# EAGLE design SHIELD (EAGLE 9.6.2)
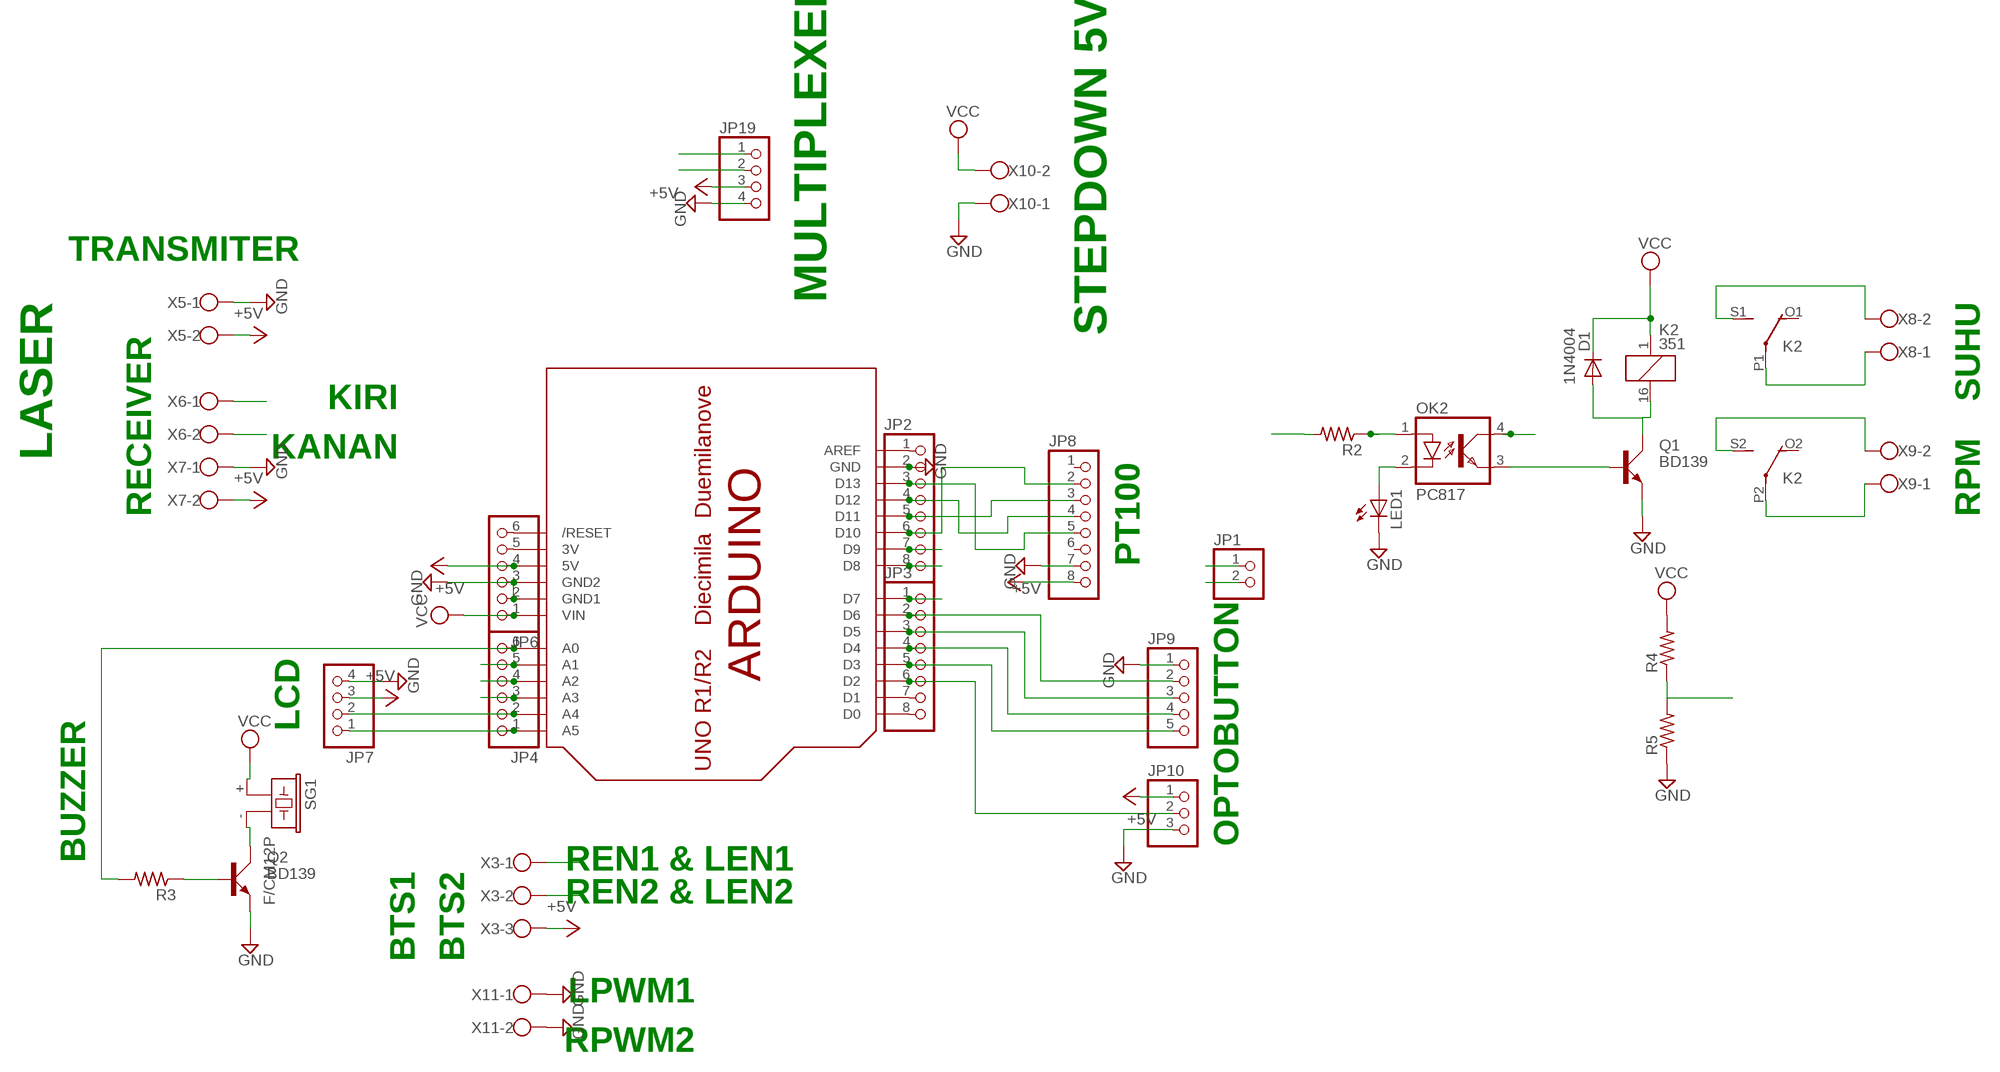
[diagram p0: schematic, sheet 1]

## Parts
D1  1N4004  [DO41-10]
JP1  PINHD-1X2  [1X02]
JP2  PINHD-1X8  [1X08]
JP3  PINHD-1X8  [1X08]
JP4  PINHD-1X6  [1X06]
JP6  PINHD-1X6  [1X06]
JP7  PINHD-1X4  [1X04]
JP8  PINHD-1X8  [1X08]
JP9  PINHD-1X5  [1X05]
JP10  PINHD-1X3  [1X03]
JP19  PINHD-1X4  [1X04]
K2  351  [351]
LED1  LED5MM  [LED5MM]
OK2  PC817  [DIL04]
Q1  BD139  [TO126AV]
Q2  BD139  [TO126AV]
R2  R-US_0207/10  [0207/10]
R3  R-US_0207/10  [0207/10]
R4  R-US_0207/10  [0207/10]
R5  R-US_0207/10  [0207/10]
SG1  F/CM12P  [F/CM12P]
U$1  ARDUINO-NOHOLE  [ARDUINO-NOHOLE]
X3  W237-103  [W237-103]
X5  W237-102  [W237-102]
X6  W237-102  [W237-102]
X7  W237-102  [W237-102]
X8  W237-102  [W237-102]
X9  W237-102  [W237-102]
X10  W237-102  [W237-102]
X11  W237-102  [W237-102]

## Nets
+5V: JP6.4 JP7.3 JP8.8 JP10.1 JP19.3 U$1.5V X3.3 X5.2 X7.2
GND: JP2.2 JP6.2 JP6.3 JP7.4 JP8.7 JP9.1 JP10.3 JP19.4 LED1.K(C) Q1.E Q2.E R5.1 U$1.GND U$1.GND1 U$1.GND2 X5.1 X7.1 X10.1 X11.1 X11.2
N$1: JP1.1 JP1.2 JP2.7 U$1.D9
N$2: Q2.B R3.1
N$3: Q2.C SG1.-
N$4: JP2.1 U$1.AREF
N$5: JP3.7 U$1.D1
N$6: JP3.8 U$1.D0
N$9: JP4.2 JP7.2 JP19.2 U$1.A4
N$10: JP4.1 JP7.1 JP19.1 U$1.A5
N$11: JP2.6 JP8.2 U$1.D10
N$12: JP2.5 JP8.3 U$1.D11
N$13: JP2.4 JP8.4 U$1.D12
N$14: JP6.5 U$1.3V
N$15: JP6.6 U$1.RESET(/RESET)
N$18: JP2.3 JP8.5 U$1.D13
N$19: JP3.5 JP9.5 U$1.D3
N$20: JP3.4 JP9.4 U$1.D4
N$21: JP3.3 JP9.3 U$1.D5
N$22: JP3.2 JP9.2 U$1.D6
N$23: JP3.6 JP10.2 U$1.D2
N$24: JP4.6 R3.2 U$1.A0
N$26: JP4.4 U$1.A2 X3.2
N$27: JP3.1 U$1.D7 X6.2
N$28: JP4.5 U$1.A1 X3.1
N$29: JP2.8 U$1.D8 X6.1
N$30: D1.A K2.16 Q1.C
N$31: OK2.3(EMIT) Q1.B
N$32: JP4.3 R2.2 U$1.A3
N$33: LED1.A OK2.2(C)
N$34: OK2.1(A) R2.1
N$35: K2.S1(2:S) X8.2
N$36: K2.P2(3:P) X9.1
N$37: OK2.4(COL) R4.1 R5.2
N$38: K2.S2(3:S) X9.2
N$39: K2.P1(2:P) X8.1
VCC: D1.C JP6.1 K2.1 R4.2 SG1.+ U$1.VIN X10.2
Unconnected: JP8.1 JP8.6 K2.O1(2:O) K2.O2(3:O)

## Notes on the sheet
- TRANSMITER
- LASER | MULTIPLEXER
- STEPDOWN 5V
- KIRI
- SUHU
- KANAN
- RECEIVER | RPM
- PT100
- LCD
- BUTTON
- REN1 & LEN1 | OPTO
- BUZZER
- REN2 & LEN2
- BTS1 | BTS2
- LPWM1
- RPWM2

## Library data of the parts
D1 = adafruit:1N4004: DIODE General purpose 1N400x type rectifier (With bigger pads) http://www.ladyada.net/library/pcb/eaglelibrary.html
JP1 = pinhead:PINHD-1X2: PIN HEADER
JP2 JP3 JP8 = pinhead:PINHD-1X8: PIN HEADER
JP4 JP6 = pinhead:PINHD-1X6: PIN HEADER
JP7 JP19 = pinhead:PINHD-1X4: PIN HEADER
JP9 = pinhead:PINHD-1X5: PIN HEADER
JP10 = pinhead:PINHD-1X3: PIN HEADER
K2 = relay:351: RELAY 2 x switch, Omron; OC_FARNELL: unknown; OC_NEWARK: unknown
LED1 = adafruit:LED: LED OSRAM: - CHIPLED LG R971, LG N971, LY N971, LG Q971, LY Q971, LO R971, LY R971 LH N974, LH R974 LS Q976, LO Q976, LY Q976 LO Q996 - Hyper CHIPLED LW Q18S LB Q993, LB Q99A, LB R99A - SideLED LS A670, LO A670, LY A670, LG A670, LP A670 LB A673, LV A673, LT A673, LW A673 LH A674 LY A675 LS A676, LA A676, LO A676, LY A676, LW A676 LS A679, LY A679, LG A679 - Hyper Micro SIDELED® LS Y876, LA Y876, LO Y876, LY Y876 LT Y87S - SmartLED LW L88C, LW L88S LB L89C, LB L89S, LG L890 LS L89K, LO L89K, LY L89K LS L896, LA L896, LO L896, LY L896 - TOPLED LS T670, LO T670, LY T670, LG T670, LP T670 LSG T670, LSP T670, LSY T670, LOP T670, LYG T670 LG T671, LOG T671, LSG T671 LB T673, LV T673, LT T673, LW T673 LH T674 LS T676, LA T676, LO T676, LY T676, LB T676, LH T676, LSB T676, LW T676 LB T67C, LV T67C, LT T67C, LS T67K, LO T67K, LY T67K, LW E67C LS E67B, LA E67B, LO E67B, LY E67B, LB E67C, LV E67C, LT E67C LW T67C LS T679, LY T679, LG T679 LS T770, LO T770, LY T770, LG T770, LP T770 LB T773, LV T773, LT T773, LW T773 LH T774 LS E675, LA E675, LY E675, LS T675 LS T776, LA T776, LO T776, LY T776, LB T776 LHGB T686 LT T68C, LB T68C - Hyper Mini TOPLED® LB M676 - Mini TOPLED Santana® LG M470 LS M47K, LO M47K, LY M47K Source: http://www.osram.convergy.de/
OK2 = optocoupler:PC817: SHARP OPTO COUPLER; MPN: PC817X4J000F; OC_FARNELL: 9707727; OC_NEWARK: 97K7059
Q1 Q2 = transistor-power:BD139: NPN TRANSISTOR
R2-R5 = rcl:R-US_: RESISTOR, American symbol; SPICEPREFIX: R
SG1 = buzzer:F/CM12P: BUZZER Source: Buerklin; OC_FARNELL: unknown; OC_NEWARK: unknown
U$1 = adafruit:ARDUINO: Arduino Diecimila/Duemilanove Make a shield with ease, this package has all the named pins as well as the two mounting drill holes and an outline of the USB and DC power connector. The outline is on the DIMENSION layer, so if your board house uses it they will cut the outline to match. http://www.ladyada.net/library/pcb/eaglelibrary.html
X3 = con-wago-500:W237-103: WAGO SCREW CLAMP; MPN: 237-103; OC_FARNELL: unknown; OC_NEWARK: 18M7116
X5-X11 = con-wago-500:W237-102: WAGO SCREW CLAMP; MPN: 237-102; OC_FARNELL: unknown; OC_NEWARK: 70K9898

## Board
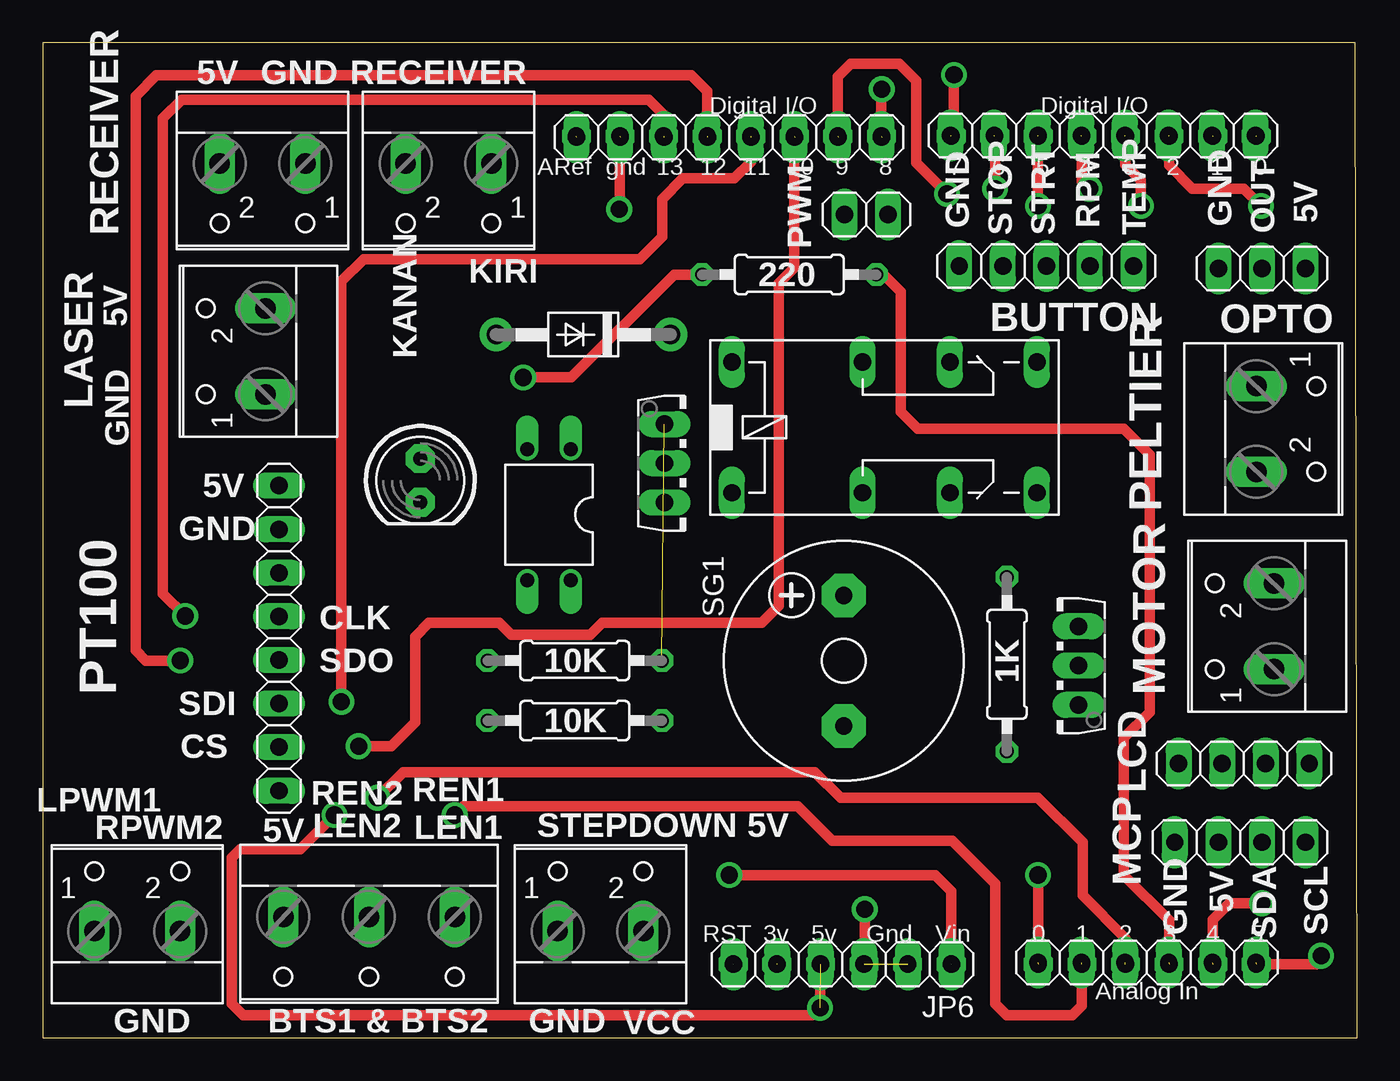
[diagram p1: board, top side]
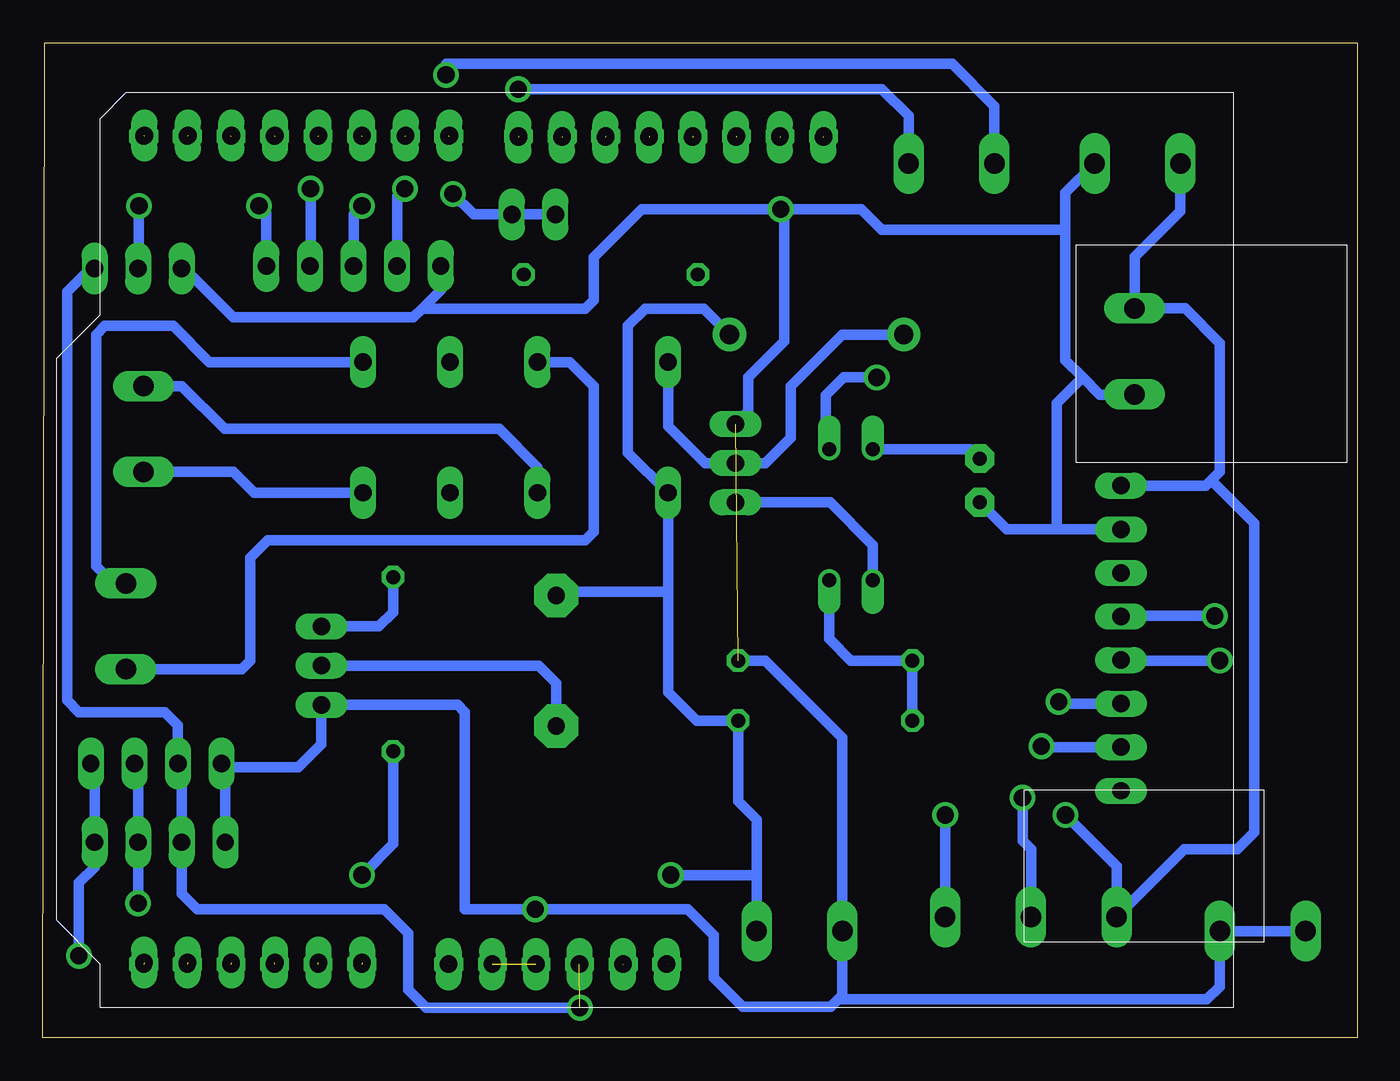
[diagram p2: board, bottom side, seen from below]

Size 76.6 x 58 mm. Coordinates in mm from the lower left corner, seen from the top.
Outline: 0,0 76.6,0 76.5,58 0,58 0,0
Copper layers (1*16): Top 0.035mm / dielectric 1.5mm / Bottom 0.035mm
Design rules "default": minimum track width 6mil, minimum drill 0.35mm, track to track 6mil, track to pad 6mil, pad to pad 6mil, via to via 6mil, smd to smd 6mil, copper to edge 40mil, drill to drill 6mil, minimum pad ring 10mil, minimum via ring 8mil, stop-mask expansion 4mil, vias tented up to drill 0mil, thermal gap 10mil

### Footprints (pad centres in the part's own frame; a part is rotated, then mirrored left to right if it is on the bottom)
DO41-10 = drill 1.118 pad 1.93: A 5.08,0; C -5.08,0
1X02 = drill 1.016 long: 1 -1.27,0; 2 1.27,0
1X08 = drill 1.016 long: 1 -8.89,0; 2 -6.35,0; 3 -3.81,0; 4 -1.27,0; 5 1.27,0; 6 3.81,0; 7 6.35,0; 8 8.89,0
1X06 = drill 1.016 long: 1 -6.35,0; 2 -3.81,0; 3 -1.27,0; 4 1.27,0; 5 3.81,0; 6 6.35,0
1X04 = drill 1.016 long: 1 -3.81,0; 2 -1.27,0; 3 1.27,0; 4 3.81,0
1X05 = drill 1.016 long: 1 -5.08,0; 2 -2.54,0; 3 0,0; 4 2.54,0; 5 5.08,0
1X03 = drill 1.016 long: 1 -2.54,0; 2 0,0; 3 2.54,0
351 = drill 1.016 long: 1 -3.81,-3.81; 16 -3.81,3.81; O1 8.89,-3.81; O2 8.89,3.81; P1 3.81,-3.81; P2 3.81,3.81; S1 13.97,-3.81; S2 13.97,3.81
LED5MM = drill 0.813 pad 1.676 octagon: A -1.27,0; K 1.27,0
DIL04 = drill 0.813 offset: 1 -1.27,-3.81; 2 1.27,-3.81; 3 1.27,3.81; 4 -1.27,3.81
TO126AV = drill 1.016 long: B 2.286,-1.27; C 0,-1.27; E -2.286,-1.27
0207/10 = drill 0.813 octagon: 1 -5.08,0; 2 5.08,0
F/CM12P = drill 1.016 pad 2.54 octagon: + 3.81,0; - -3.81,0
ARDUINO-NOHOLE = drill 1 pad 1.676 octagon: 3V 35.56,2.54; 5V 38.1,2.54; A0 50.8,2.54; A1 53.34,2.54; A2 55.88,2.54; A3 58.42,2.54; A4 60.96,2.54; A5 63.5,2.54; AREF 23.876,50.8; D0 63.5,50.8; D1 60.96,50.8; D2 58.42,50.8; D3 55.88,50.8; D4 53.34,50.8; D5 50.8,50.8; D6 48.26,50.8; D7 45.72,50.8; D8 41.656,50.8; D9 39.116,50.8; D10 36.576,50.8; D11 34.036,50.8; D12 31.496,50.8; D13 28.956,50.8; GND 26.416,50.8; GND1 43.18,2.54; GND2 40.64,2.54; RESET 33.02,2.54; VIN 45.72,2.54
W237-103 = drill 1.194 long: 1 -5,-1.29; 2 0,-1.29; 3 5,-1.29
W237-102 = drill 1.194 long: 1 -2.5,-1.27; 2 2.5,-1.27

### Placement (x,y rotation side)
D1  31.5,41 180 top
JP1  48,48 0 top
JP2  40,52.5 0 top
JP3  61.8,52.6 0 top
JP4  64.35,4.4 180 top
JP6  46.6,4.3 180 top
JP7  69.78,11.41 180 top
JP8  13.76,23.3 90 top
JP9  58.49,44.99 0 top
JP10  71.05,44.86 180 top
JP19  70,16 180 top
K2  43.97,35.59 0 top
LED1  22,32.5 270 top
OK2  29.5,30.5 180 top
Q1  37.5,33.5 270 top
Q2  59.1,21.7 90 top
R2  43.5,44.5 0 top
R3  56.19,21.78 270 top
R4  31,18.5 0 top
R5  31,22 180 top
SG1  46.68,21.99 90 top
U$1  7.22,1.77 0 top
X3  19.01,5.77 180 top
X5  11.7,40.02 90 top
X6  23.64,49.7 180 top
X7  12.8,49.7 180 top
X8  72,35.5 270 top
X9  70.5,24 90 top
X10  32.5,7.5 0 top
X11  5.5,7.5 0 top

### Tracks (layer width: path | path; a pad name or v marks a point on that pad's centre or on a via)
+5V  (via drill 1 pad 1)  (1 unrouted)
  Top 0.61: U$1.5V 45.3,4.29 v45.3,1.77 44.85,1.32 11.68,1.32 11,2 11,10.5 11.5,11 15,11 v17,13
  Bottom 0.61: JP7.3 68.51,15.78 JP19.3 68.73,18.23 69.5,19 74.5,19 75.18,19.68 75.18,43.5 73.82,44.86 JP10.1 | JP8.8 8.81,32.19 8.5,32.5 | 8.5,32.5 8,33 8,40.5 10.02,42.52 X5.2 12.97,45.53 10.3,48.2 X7.2 | JP7.3 | 8.5,32.5 6,30 6,12 7,11 10.07,11 X3.3 14.01,10.01 v17,13 | v45.3,1.77 54.27,1.77 55.3,2.8 55.3,6.1 56.7,7.5 67.6,7.5 68.51,8.41 JP7.3
GND  (via drill 1 pad 1)  (5 unrouted)
  Top 0.61: U$1.GND2 47.9,4.31 v47.9,7.5 | U$1.GND 33.64,48.34 v33.6,48.3
  Bottom 0.61: JP7.4 65.97,15.78 | 65.97,15.78 JP19.4 | 65.97,15.78 61.72,15.78 60.37,17.13 Q2.E 52.41,19.41 52,19 52,7.5 v47.9,7.5 39,7.5 37.5,6 37.5,3.5 35.82,1.82 30.68,1.82 30.25,2.25 | R5.1 34.5,22 30,17.5 X10.1 30,2.5 30.25,2.25 | Q1.E 35.5,36.52 35.5,38.5 33.4,40.6 33.4,48.1 v33.6,48.3 | X11.1 X11.2 8,3 8.75,2.25 30.25,2.25 | X7.1 17,49.27 17,47.1 | 16,38.5 17,39.5 17,47.1 | 16,38.5 15,37.5 12.99,37.5 X5.1 | LED1.K 20.42,29.65 17.5,29.65 | 17.5,29.65 JP8.7 | JP9.1 53.41,43.59 54.5,42.5 | 54.5,42.5 55,42 65.5,42 68.36,44.86 JP10.3 | v33.6,48.3 41.7,48.3 44.5,45.5 44.5,43 45,42.5 54.5,42.5 | 16,38.5 17.5,37 17.5,29.65 | 17,47.1 27.7,47.1 28.9,48.3 v33.6,48.3
N$1  (via drill 1)  (1 unrouted)
  Top 0.61: U$1.D9 46.34,56.02 47.1,56.78 49.9,56.78 50.9,55.78 50.9,51 v52.7,49.2
  Bottom 0.61: v52.7,49.2 51.5,48 JP1.2 JP1.1
N$2
  Bottom 0.61: R3.1 56.19,24.81 57.01,23.99 Q2.B
N$3
  Bottom 0.61: SG1.- 46.68,20.68 47.7,21.7 Q2.C
N$4  (1 unrouted)
N$5  (1 unrouted)
N$6  (1 unrouted)
N$9  (via drill 1 pad 1)  (1 unrouted)
  Top 0.61: U$1.A4 68.18,6.88 69.15,7.85 v71.05,7.85
  Bottom 0.61: JP19.2 71.05,15.78 JP7.2 v71.05,7.85 71,7.8
N$10  (via drill 1 pad 1)  (1 unrouted)
  Top 0.61: U$1.A5 74.21,4.31 74.7,4.8 v74.5,4.8
  Bottom 0.61: JP19.1 73.59,15.78 JP7.1 73.59,9.95 74.5,9.04 v74.5,4.8
N$11  (via drill 1 pad 1)  (1 unrouted)
  Top 0.61: U$1.D10 43.8,44.9 42.9,44 42.9,25.2 41.9,24.2 32.6,24.2 31.9,23.5 27.3,23.5 26.6,24.2 22.5,24.2 21.7,23.4 21.7,18.4 20.3,17 v18.4,17
  Bottom 0.61: v18.4,17 18.35,16.95 JP8.2
N$12  (via drill 1 pad 1)  (1 unrouted)
  Top 0.61: U$1.D11 41.26,51.06 40.3,50.1 37.3,50.1 36.1,48.9 36.1,46.7 34.8,45.4 18.7,45.4 17.4,44.1 v17.4,19.6
  Bottom 0.61: v17.4,19.6 17.29,19.49 JP8.3
N$13  (via drill 1 pad 1)  (1 unrouted)
  Top 0.61: U$1.D12 38.72,55.18 37.8,56.1 6.6,56.1 5.4,54.9 5.4,22.6 6,22 v8,22
  Bottom 0.61: v8,22 13.73,22 JP8.4
N$14  (1 unrouted)
N$15  (1 unrouted)
N$18  (via drill 1 pad 1)  (1 unrouted)
  Top 0.61: U$1.D13 36.18,53.82 35.3,54.7 8.1,54.7 7,53.6 7,25.9 v8.3,24.6
  Bottom 0.61: v8.3,24.6 13.73,24.6 JP8.5
N$19  (via drill 1 pad 1)  (1 unrouted)
  Top 0.61: v64,48.5 64,50 63.1,50.9 U$1.D3
  Bottom 0.61: JP9.5 63.57,48.07 v64,48.5
N$20  (via drill 1 pad 1)  (1 unrouted)
  Top 0.61: U$1.D4 60.56,49.94 v61,49.5
  Bottom 0.61: v61,49.5 61,45.02 JP9.4
N$21  (via drill 1 pad 1)  (1 unrouted)
  Top 0.61: v58,48.5 58,52.55 U$1.D5
  Bottom 0.61: JP9.3 58.49,48.01 v58,48.5
N$22  (via drill 1 pad 1)  (1 unrouted)
  Top 0.61: U$1.D6 55.5,52.55 v55.5,49.5
  Bottom 0.61: v55.5,49.5 55.95,49.05 JP9.2
N$23  (via drill 1 pad 1)  (1 unrouted)
  Top 0.61: U$1.D2 65.64,50.86 67,49.5 70,49.5 v71,48.5
  Bottom 0.61: v71,48.5 71,44.91 JP10.2
N$24  (via drill 1 pad 1)  (1 unrouted)
  Top 0.61: v58,9.5 58.02,9.48 U$1.A0
  Bottom 0.61: v58,9.5 56.19,11.31 R3.2
N$26  (via drill 1 pad 1)  (1 unrouted)
  Top 0.61: U$1.A2 63.1,5.81 60.6,8.31 60.6,11.4 58,14 46.5,14 45,15.5 21,15.5 v19.5,14
  Bottom 0.61: v19.5,14 19.5,11.5 19,11 X3.2
N$27  (via drill 1 pad 1)  (1 unrouted)
  Top 0.61: U$1.D7 53.1,52.73 v53.1,56.13
  Bottom 0.61: v53.1,56.13 53.1,56.78 23.6,56.78 21.14,54.32 X6.2
N$28  (via drill 1 pad 1)  (1 unrouted)
  Top 0.61: v24,13 24.5,13.5 44,13.5 46,11.5 53,11.5 55.5,9 55.5,2 56.18,1.32 60,1.32 60.56,1.88 U$1.A1
  Bottom 0.61: v24,13 v24.01,12.99 X3.1
N$29  (via drill 1 pad 1)  (1 unrouted)
  Top 0.61: v48.9,55.3 48.88,55.28 U$1.D8
  Bottom 0.61: v48.9,55.3 27.7,55.3 26.14,53.74 X6.1
N$30
  Bottom 0.61: D1.A 30,41 33,38 33,35 34.5,33.5 Q1.C 38,33.5 40.16,35.66 K2.16
N$31
  Bottom 0.61: OK2.3 28.23,28.73 30.71,31.21 Q1.B
N$32  (1 unrouted)
  Top 0.61: R2.2 49,44.5 50,43.5 50,36.5 51,35.5 63,35.5 64.5,34 64.5,19 63,17.5 63,9.5 65.64,6.86 U$1.A3
N$33
  Bottom 0.61: LED1.A 22.54,34.31 OK2.2
N$34  (via drill 1 pad 1)
  Top 0.61: R2.1 36.8,44.5 30.8,38.5 v28,38.5
  Bottom 0.61: v28,38.5 29.92,38.5 30.96,37.46 30.96,34.5 OK2.1
N$35
  Bottom 0.61: K2.S1 64.28,31.78 65.5,33 X8.2
N$36
  Bottom 0.61: K2.P2 45.9,39.4 44.5,38 44.5,29.5 45,29 63.5,29 64.5,28 64.5,22 65,21.5 X9.1
N$37
  Bottom 0.61: R4.1 R5.2 29.5,22 30.77,23.27 OK2.4
N$38
  Bottom 0.61: X9.2 72.5,26.5 73.5,27.5 73.5,41 73,41.5 69,41.5 66.9,39.4 K2.S2
N$39
  Bottom 0.61: K2.P1 47.78,33.28 50,35.5 66,35.5 68.5,38 X8.1
VCC  (via drill 1 pad 1)  (1 unrouted)
  Top 0.61: U$1.VIN 52.94,8.56 52,9.5 v40,9.5
  Bottom 0.61: X10.2 35,9.5 | 35,9.5 35,12.73 36.08,13.81 R4.2 38.5,18.5 40.16,20.16 40.16,26 | 40.16,26 K2.1 42.5,34.12 42.5,41.5 41.5,42.5 38.08,42.5 D1.C | v40,9.5 35,9.5 | SG1.+ 46.48,26 40.16,26

### Text on the board
tNames: 5V | GND | RECEIVER | GND | RPM | GND | 5V | RECEIVER | STOP | STRT | TEMP | OUT | PWM | 5V | KIRI | 220 | BUTTON | OPTO | GND | KANAN | LASER | 5V | PELTIER | GND | CLK | SDO | 10K | 1K | PT100 | MOTOR | SDI | 10K | CS | REN2 | REN1 | LPWM1 | LCD | RPWM2 | LEN2 | LEN1 | 5V | STEPDOWN 5V | MCP | 5V | GND | SDA | SCL | GND | BTS1 & BTS2 | GND | VCC